# EAGLE design Potentiostat_VREF (EAGLE 8.2.2)
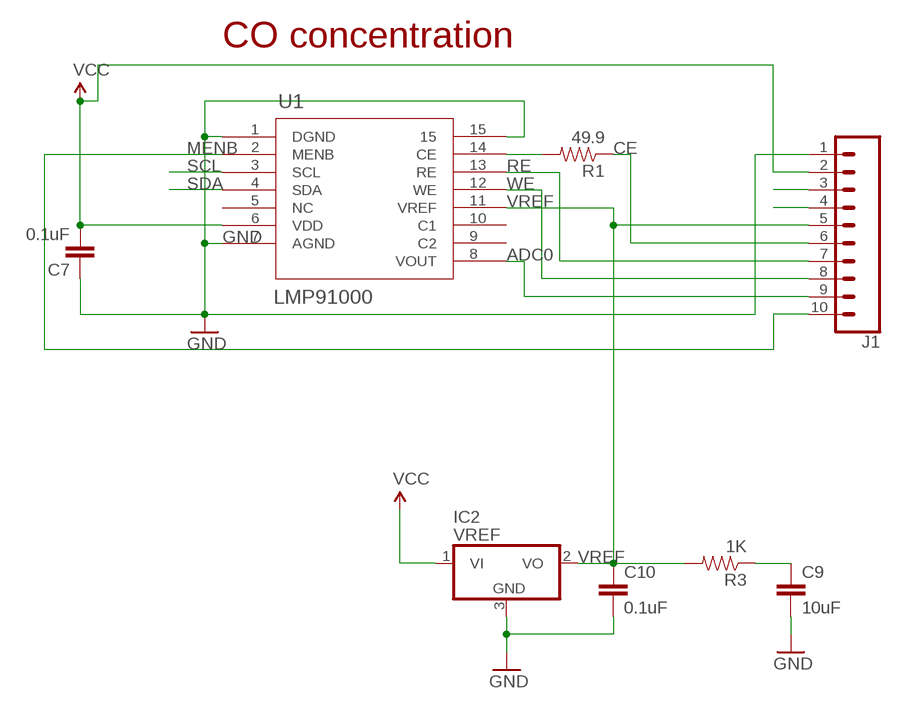
[diagram p0: schematic, sheet 1]

## Parts
C7  0.1uF  CAP0805  [0805]
C9  10uF  CAP0805  [0805]
C10  0.1uF  CAP0805  [0805]
IC2  VREF  ISL60002DIH320ZCB  [SOT23]
J1  CONN_10"  [1X10]
R1  49.9  RESISTOR0805-RES  [0805]
R3  1K  RESISTOR0805-RES  [0805]
U1  LMP91000  LMP91000_NHL_14  [SDA14B]

## Nets
ADC0: J1.9 U1.8(VOUT)
CE: J1.6 R1.1
GND: C7.1 C9.2 C10.2 IC2.3(GND) J1.1 U1.1(DGND) U1.7(AGND) U1.15
MENB: J1.10 U1.2(MENB)
N$2: J1.3
N$3: J1.4
N$9: R1.2 U1.14(CE)
N$10: C9.1 R3.1
RE: J1.7 U1.13(RE)
SCL: U1.3(SCL)
SDA: U1.4(SDA)
VCC: C7.2 IC2.1(VI) J1.2 U1.6(VDD)
VREF: C10.1 IC2.2(VO) J1.5 R3.2 U1.11(VREF)
WE: J1.8 U1.12(WE)
Unconnected: U1.5(NC) U1.9(C2) U1.10(C1)

## Notes on the sheet
- CO concentration

## Library data of the parts
C7 C10 = SparkFun-Passives:CAP: Capacitor Standard 0603 ceramic capacitor, and 0.1" leaded capacitor.; MPN: AC0805KRX7R9BB104
C9 = SparkFun-Passives:CAP: Capacitor Standard 0603 ceramic capacitor, and 0.1" leaded capacitor.; MPN: CC0805ZKY5V6BB106
IC2 = linear:ISL60002DIH320Z: ISL60002DIH320Z; MPN: ISL60002DIH320Z-TK
J1 = SparkFun-Connectors:CONN_10: Multi connection point. Often used as Generic Header-pin footprint for 0.1 inch spaced/style header connections On any of the 0.1 inch spaced packages, you can populate with these: Break Away Headers - Straight <https://www.sparkfun.com/products/116> (PRT-00116) Break Away Male Headers - Right Angle <https://www.sparkfun.com/products/553> (PRT-00553) Female Headers <https://www.sparkfun.com/products/115> (PRT-00115) Break Away Headers - Machine Pin <https://www.sparkfun.com/products/117> (PRT-00117) Break Away Female Headers - Swiss Machine Pin <https://www.sparkfun.com/products/743> (PRT-00743) Arduino Stackable Header - 10 Pin <https://www.sparkfun.com/products/11376> (PRT-11376) For SCREWTERMINALS and SPRING TERMINALS visit here: Screw Terimnals on SparkFun.com <https://www.sparkfun.com/search/results?term=Screw+Terminals> (5mm/3.5mm/2.54mm spacing) This device is also useful as a general connection point to wire up your design to another part of your project. Our various solder wires solder well into these plated through hole pads. Hook-Up Wire - Assortment (Stranded, 22 AWG) <https://www.sparkfun.com/products/11375> (PRT-11375) Hook-Up Wire - Assortment (Solid Core, 22 AWG) <https://www.sparkfun.com/products/11367> (PRT-11367) View the entire wire category on our website here <https://www.sparkfun.com/categories/141> Special notes: Molex polarized connector foot print use with SKU : PRT-08231 with associated crimp pins and housings. 1MM SMD Version SKU: PRT-10208 NOTES ON THE VARIANTS LOCK and LOCK_LONGPADS... This footprint was designed to help hold the alignment of a through-hole component (i.e. 6-pin header) while soldering it into place. You may notice that each hole has been shifted either up or down by 0.005 of an inch from it's more standard position (which is a perfectly straight line). This slight alteration caused the pins (the squares in the middle) to touch the edges of the holes. Because they are alternating, it causes a "brace" to hold the component in place. 0.005 has proven to be the perfect amount of "off-center" position when using our standard breakaway headers. Although looks a little odd when you look at the bare footprint, once you have a header in there, the alteration is very hard to notice. Also,if you push a header all the way into place, it is covered up entirely on the bottom side.; PROD_ID: CONN-11563
R1 = SparkFun-Passives:RESISTOR: Resistor Basic schematic elements and footprints for 0603, 1206, and PTH resistors.; MPN: RC0805FR-0749R9L
R3 = SparkFun-Passives:RESISTOR: Resistor Basic schematic elements and footprints for 0603, 1206, and PTH resistors.; MPN: RC0805JR-071KL
U1 = LMP91000:LMP91000_NHL_14; BASEPN: LMP91000; DATASHEETURL: http://www.ti.com/lit/ds/symlink/lmp91000.pdf; DESCRIPTION: Configurable AFE Potentiostat for Low-Power Chemical Sensing Applications; MANUFACTURER: Texas Instruments; MANUFACTURER_PART_NUMBER: lmp91000_nhl_14; MPN: LMP91000; NSC_PACKAGEREFERENCE: SDA14B; VENDOR: Texas Instruments

## Board
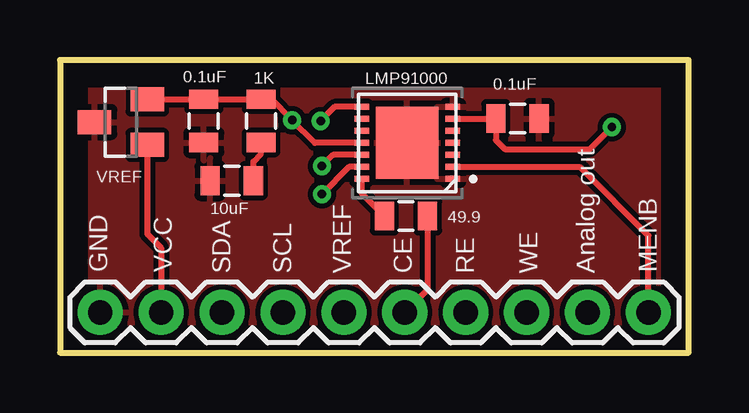
[diagram p1: board, top side]
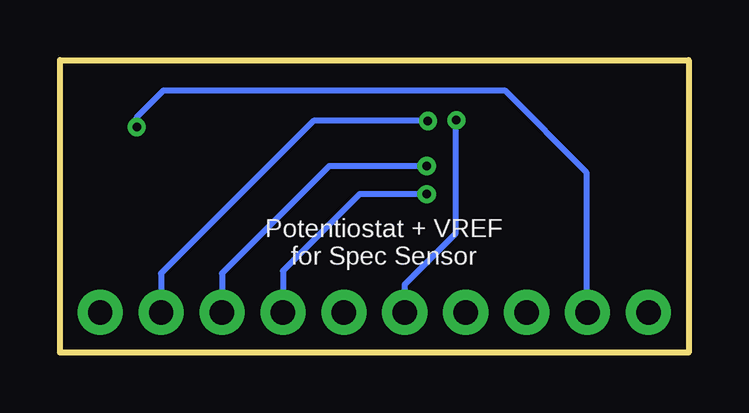
[diagram p2: board, bottom side, seen from below]

Size 26.21 x 12.19 mm. Coordinates in mm from the lower left corner, seen from the top.
Outline: 0,0 26.21,0 26.21,12.19 0,12.19 0,0
Copper layers (1*16): Top 0.035mm / dielectric 1.5mm / Bottom 0.035mm
Design rules "default": minimum track width 10mil, minimum drill 24mil, track to track 8mil, track to pad 8mil, pad to pad 8mil, via to via 8mil, smd to smd 8mil, copper to edge 40mil, drill to drill 8mil, minimum pad ring 10mil, minimum via ring 8mil, stop-mask expansion 4mil, vias tented up to drill 0mil, thermal gap 10mil

### Footprints (pad centres in the part's own frame; a part is rotated, then mirrored left to right if it is on the bottom)
0805 = smd 0.8 x 1.2: 1 -0.9,0; 2 0.9,0
SOT23 = smd 1 x 1.4: 1 -0.95,-1.1; 2 0.95,-1.1; 3 0,1.1
1X10 = drill 1.016 pad 1.88: 1 0,0; 2 2.54,0; 3 5.08,0; 4 7.62,0; 5 10.16,0; 6 12.7,0; 7 15.24,0; 8 17.78,0; 9 20.32,0; 10 22.86,0
SDA14B = smd 0.6 x 0.25: 1 -1.9,1.5; 2 -1.9,1; 3 -1.9,0.5; 4 -1.9,0; 5 -1.9,-0.5; 6 -1.9,-1; 7 -1.9,-1.5; 8 1.9,-1.5; 9 1.9,-1; 10 1.9,-0.5; 11 1.9,0; 12 1.9,0.5; 13 1.9,1; 14 1.9,1.5 | smd 2.6 x 3: 15 0,0

### Placement (x,y rotation side)
C7  19.08,9.75 180 top
C9  7.16,7.16 180 top
C10  5.99,9.65 270 top
IC2  2.54,9.6 90 top
J1  1.68,1.68 0 top
R1  14.43,5.69 180 top
R3  8.38,9.65 90 top
U1  14.48,8.74 180 top

### Tracks (layer width: path | path; a pad name or v marks a point on that pad's centre or on a via)
ADC0  (via drill 0.35)
  Top 0.254: U1.8 11.46,10.24 v10.87,9.65
  Bottom 0.254: J1.9 22,3.3 15.65,9.65 v10.87,9.65
CE
  Top 0.254: R1.1 15.33,2.63 J1.6
GND
  pour Top: -0.15,12.5 26.52,12.5 26.52,-0.25 -0.2,-0.25 -0.2,12.45 -0.2,12.5
MENB
  Top 0.254: U1.2 21.68,7.74 24.54,4.88 J1.10
N$9
  Top 0.254: U1.14 12.58,6.64 R1.2
N$10
  Top 0.254: R3.1 8.38,8.28 8.06,7.96 C9.1
RE  (via drill 0.35)
  Top 0.254: U1.13 12.06,7.74 v10.92,6.6
  Bottom 0.254: v10.92,6.6 13.72,6.6 16.92,3.4 J1.7
VCC  (via drill 0.35)
  Top 0.254: IC2.1 3.64,4.95 4.22,4.37 J1.2 | U1.6 18.21,9.74 C7.2 18.18,8.85 18.54,8.48 22.1,8.48 v23.01,9.4
  Bottom 0.254: v23.01,9.4 23.01,9.8 21.89,10.92 7.67,10.92 4.27,7.52 4.27,1.73 J1.2
VREF  (via drill 0.35)
  Top 0.254: IC2.2 C10.1 R3.2 8.82,10.55 v9.68,9.69 10.63,8.74 U1.11
  Bottom 0.254: J1.5 11.84,2.84 9.7,4.98 9.7,9.67 v9.68,9.69
WE  (via drill 0.35)
  Top 0.254: U1.12 11.39,8.24 v10.92,7.77
  Bottom 0.254: v10.92,7.77 14.99,7.77 19.46,3.3 J1.8

### Text on the board
tPlace: GND | VCC | MENB | SDA | SCL | VREF | CE | RE | WE | Analog out
bPlace: Potentiostat + VREF / for Spec Sensor